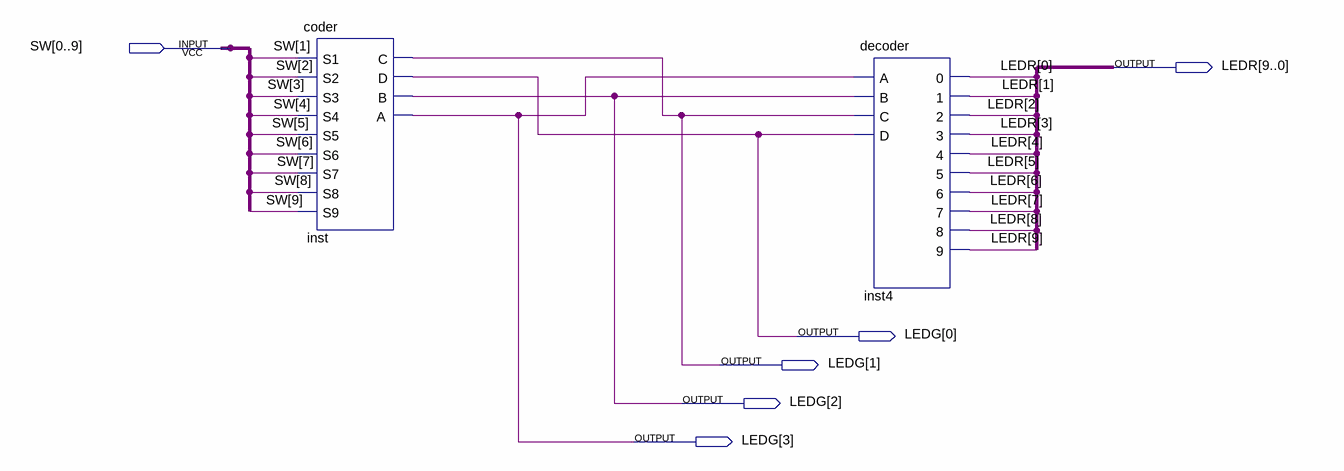
[diagram p0: schematic sheet]
// Quartus schematic coderdecoder.bdf as structural Verilog: 2 symbols, 6 pins
module coderdecoder (
  input  [0:9] SW,
  output [9:0] LEDR,
  output [3:0] LEDG
);

  coder inst (
    .S1(SW[1]), .S2(SW[2]), .S3(SW[3]), .S4(SW[4]), .S5(SW[5]), .S6(SW[6]), .S7(SW[7]), .S8(SW[8]),
    .S9(SW[9]), .C(LEDG[1]), .D(LEDG[0]), .B(LEDG[2]), .A(LEDG[3]));
  decoder inst4 (
    .A(LEDG[3]), .B(LEDG[2]), .C(LEDG[1]), .D(LEDG[0]), .\0 (LEDR[0]), .\1 (LEDR[1]), .\2 (LEDR[2]),
    .\3 (LEDR[3]), .\4 (LEDR[4]), .\5 (LEDR[5]), .\6 (LEDR[6]), .\7 (LEDR[7]), .\8 (LEDR[8]), .\9 (LEDR[9]));
endmodule
